# EAGLE schematic board (EAGLE 9.5.0)

## Sheet 1 of 2
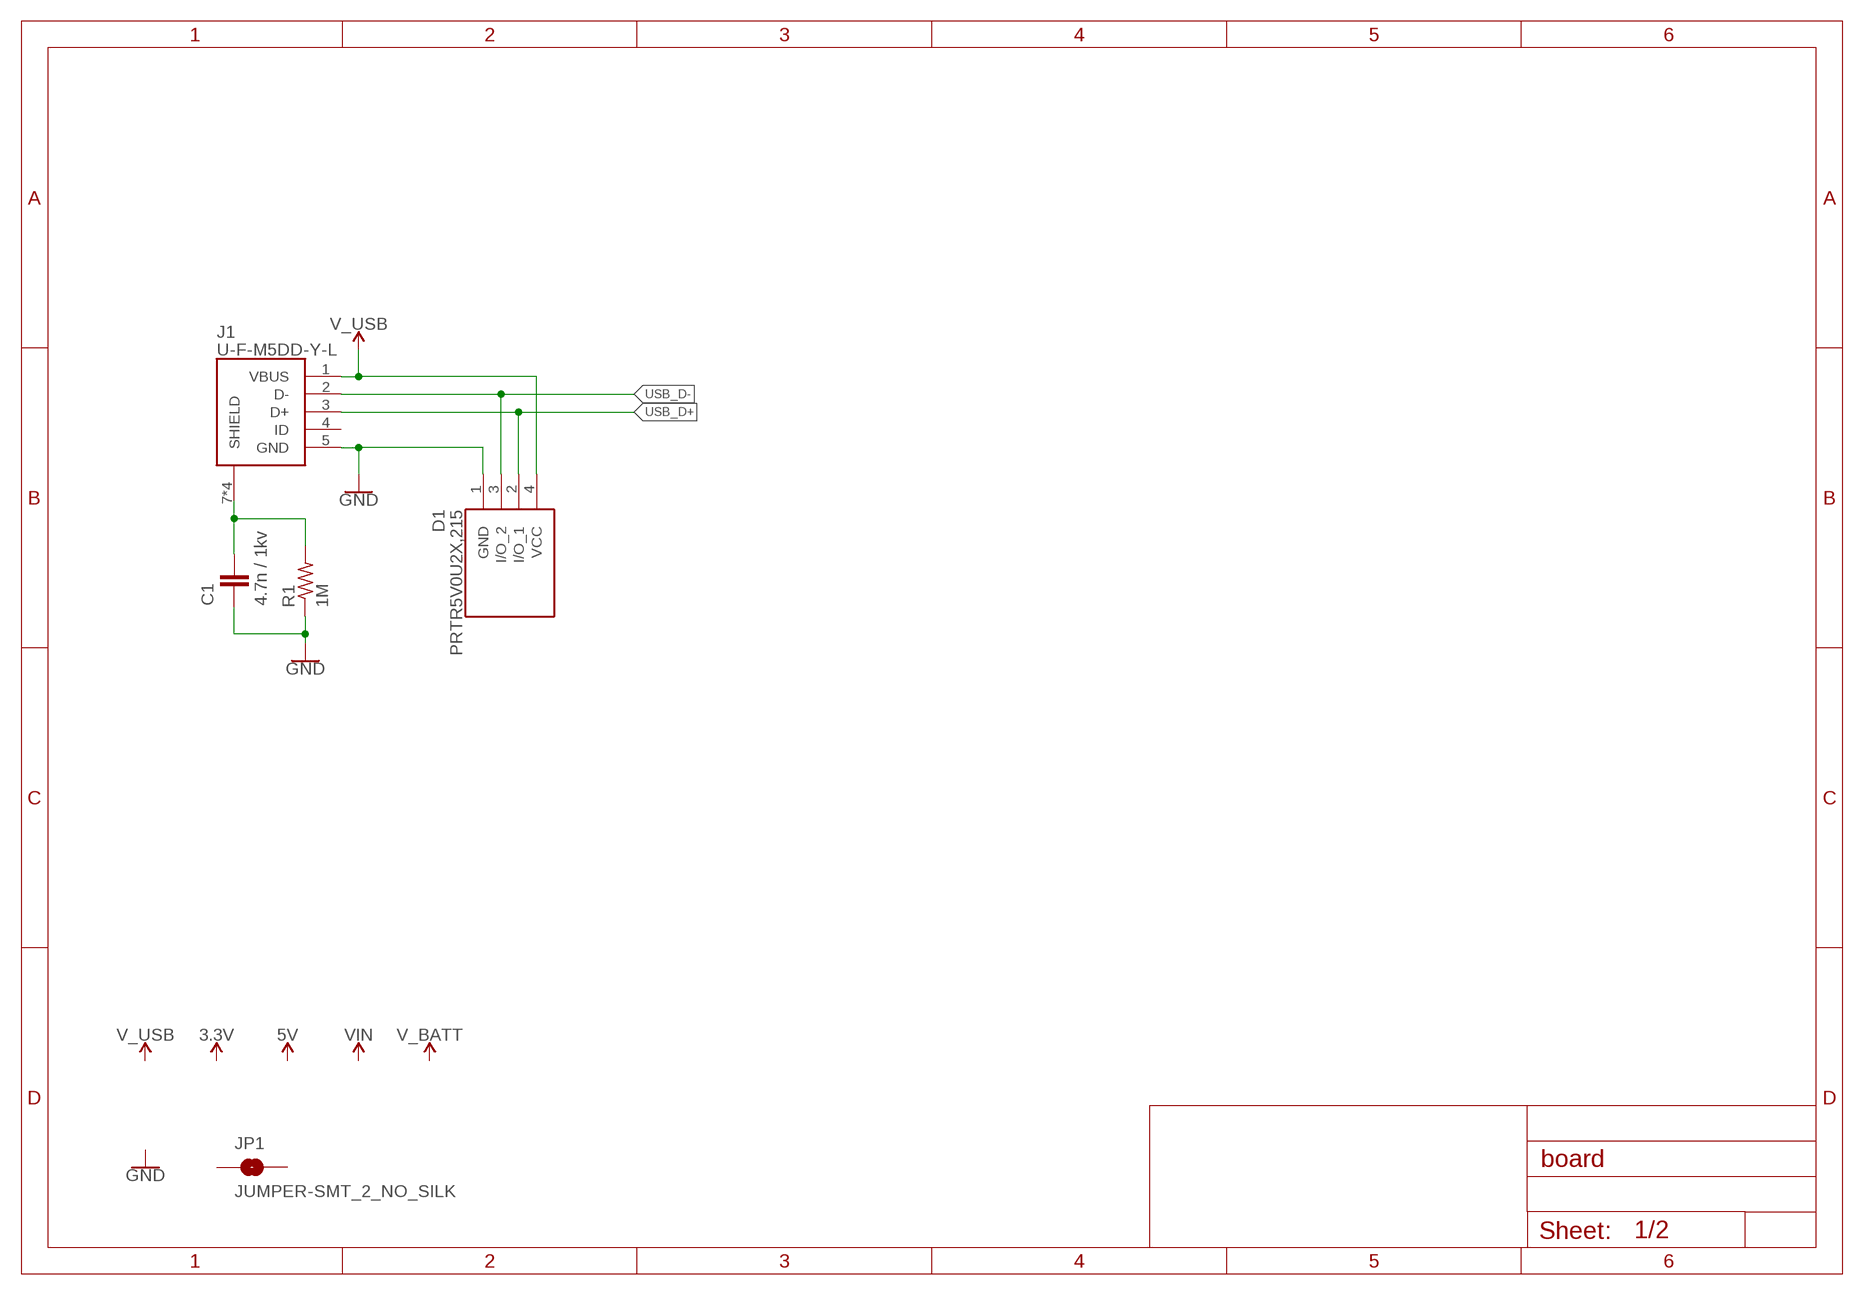
[diagram p0: schematic, sheet 1]

### Parts
C1  4.7n / 1kv  C-EUC0402K  [C0402K]
D1  PRTR5V0U2X,215  [SOT-143B]
J1  U-F-M5DD-Y-L  [UFM5DDYL]
JP1  JUMPER-SMT_2_NO_SILK  [SMT-JUMPER_2_NO_SILK]
R1  1M  R-US_R0402  [R0402]

### Nets
GND [power]: C1.2 D1.1(GND) J1.5(GND) R1.1
N$1: C1.1 J1.7(SHIELD) J1.8(SHIELD) J1.9(SHIELD) J1.10(SHIELD) R1.2
USB_D+: D1.2(I/O_1) J1.3(D+)
USB_D-: D1.3(I/O_2) J1.2(D-)
V_USB [power]: D1.4(VCC) J1.1(VBUS)
Unconnected: J1.4(ID) JP1.1 JP1.2

## Sheet 2 of 2
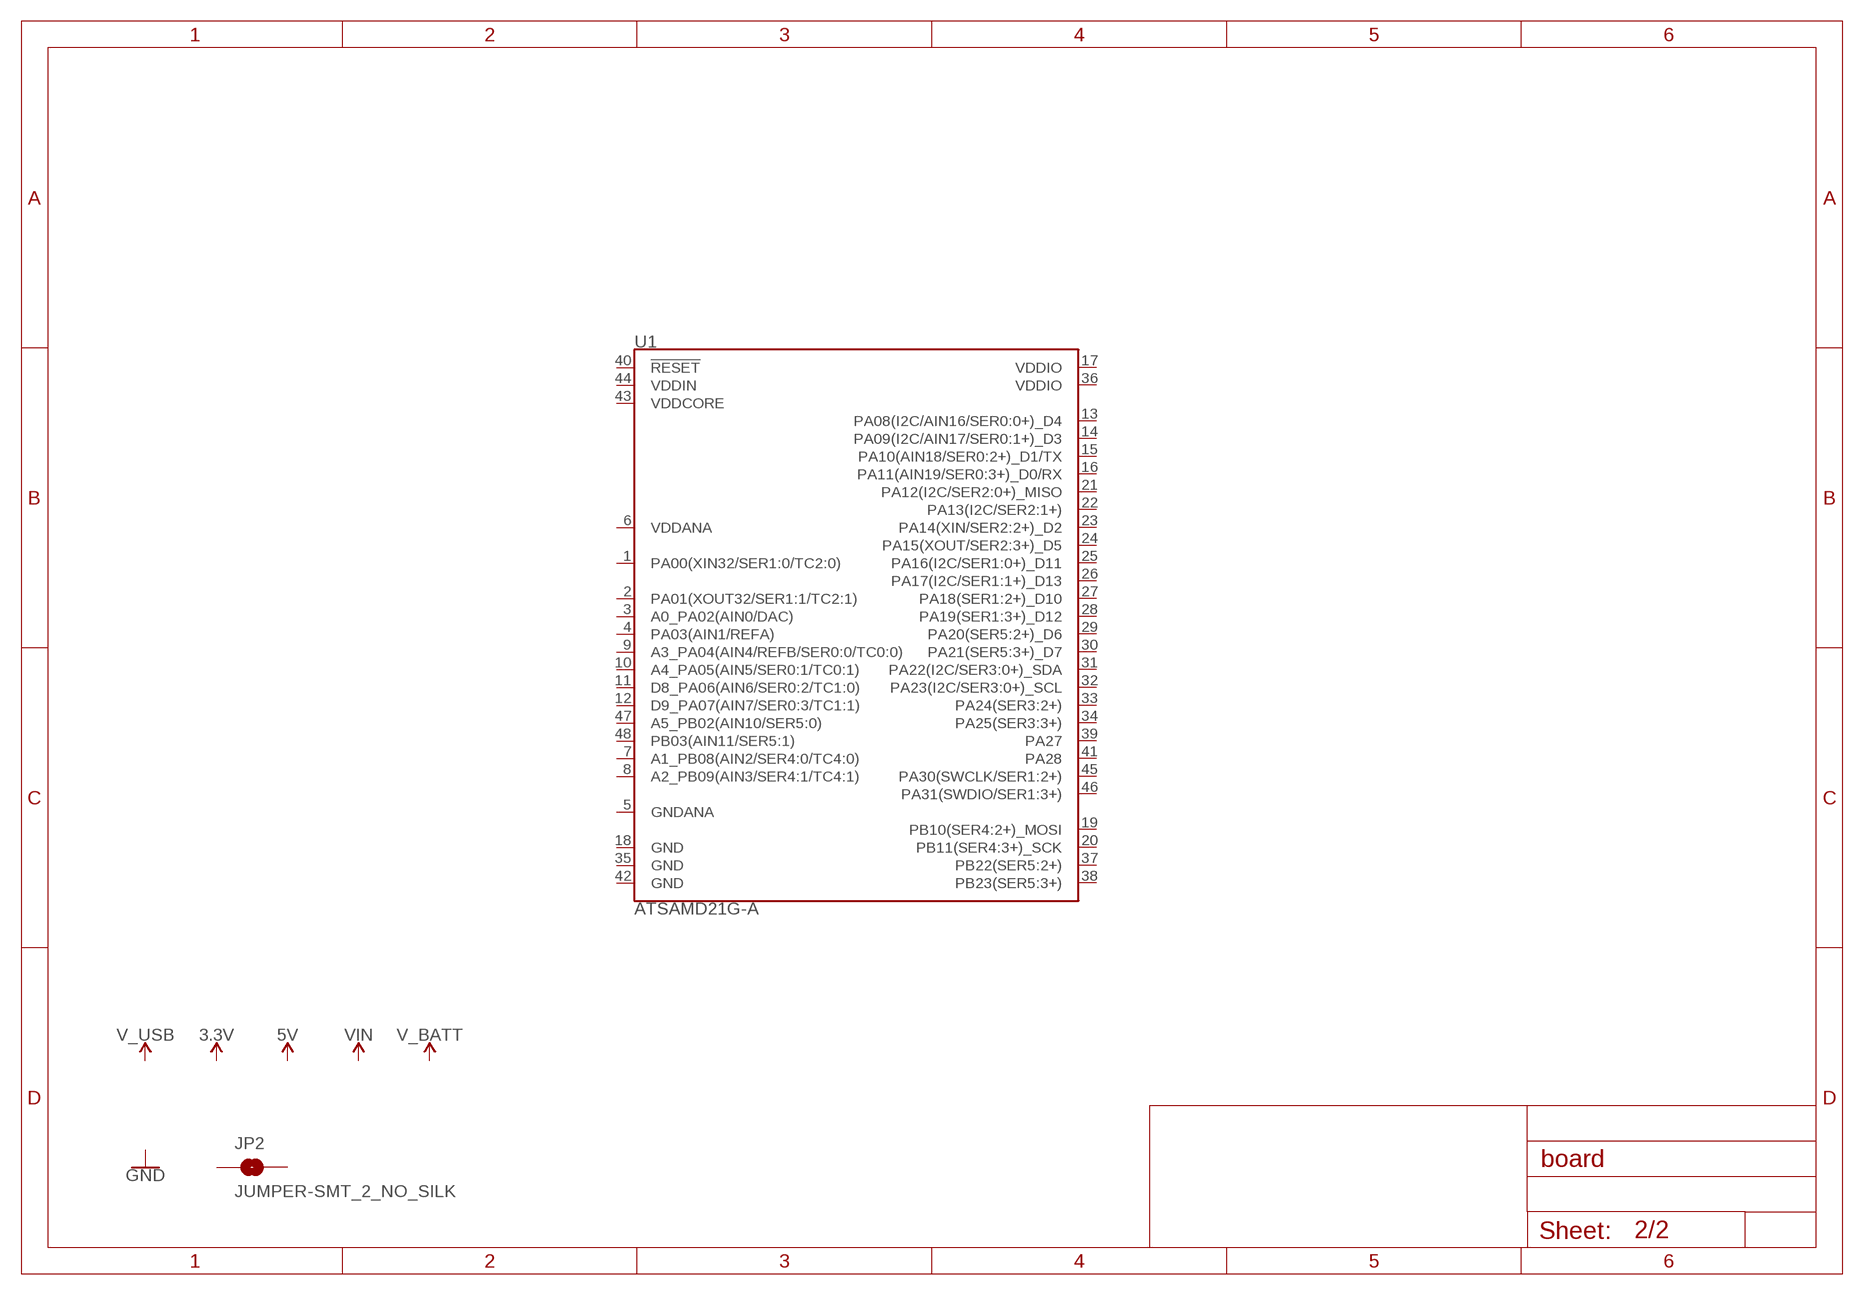
[diagram p1: schematic, sheet 2]

### Parts
JP2  JUMPER-SMT_2_NO_SILK  [SMT-JUMPER_2_NO_SILK]
U1  ATSAMD21G-A  [TQFP-48]
Unconnected: JP2.1 JP2.2 U1.1(PA00(XIN32/SER1:0/TC2:0)) U1.2(PA01(XOUT32/SER1:1/TC2:1)) U1.3(A0_PA02(AIN0/DAC)) U1.4(PA03(AIN1/REFA)) U1.5(GNDANA) U1.6(VDDANA) U1.7(A1_PB08(AIN2/SER4:0/TC4:0)) U1.8(A2_PB09(AIN3/SER4:1/TC4:1)) U1.9(A3_PA04(AIN4/REFB/SER0:0/TC0:0)) U1.10(A4_PA05(AIN5/SER0:1/TC0:1)) U1.11(D8_PA06(AIN6/SER0:2/TC1:0)) U1.12(D9_PA07(AIN7/SER0:3/TC1:1)) U1.13(PA08(I2C/AIN16/SER0:0+)_D4) U1.14(PA09(I2C/AIN17/SER0:1+)_D3) U1.15(PA10(AIN18/SER0:2+)_D1/TX) U1.16(PA11(AIN19/SER0:3+)_D0/RX) U1.17(VDDIO) U1.18(GND) U1.19(PB10(SER4:2+)_MOSI) U1.20(PB11(SER4:3+)_SCK) U1.21(PA12(I2C/SER2:0+)_MISO) U1.22(PA13(I2C/SER2:1+)) U1.23(PA14(XIN/SER2:2+)_D2) U1.24(PA15(XOUT/SER2:3+)_D5) U1.25(PA16(I2C/SER1:0+)_D11) U1.26(PA17(I2C/SER1:1+)_D13) U1.27(PA18(SER1:2+)_D10) U1.28(PA19(SER1:3+)_D12) U1.29(PA20(SER5:2+)_D6) U1.30(PA21(SER5:3+)_D7) U1.31(PA22(I2C/SER3:0+)_SDA) U1.32(PA23(I2C/SER3:0+)_SCL) U1.33(PA24(SER3:2+)) U1.34(PA25(SER3:3+)) U1.35(GND) U1.36(VDDIO) U1.37(PB22(SER5:2+)) U1.38(PB23(SER5:3+)) U1.39(PA27) U1.40(!RESET!) U1.41(PA28) U1.42(GND) U1.43(VDDCORE) U1.44(VDDIN) U1.45(PA30(SWCLK/SER1:2+)) U1.46(PA31(SWDIO/SER1:3+)) U1.47(A5_PB02(AIN10/SER5:0)) U1.48(PB03(AIN11/SER5:1))

## Library data of the parts
C1 = rcl:C-EU: CAPACITOR, European symbol; SPICEPREFIX: C
D1 = SamacSys_Parts:PRTR5V0U2X,215: ESD Protection Diodes 5.5V Dual SOT143B NXP PRTR5V0U2X,215 Dual Uni-Directional TVS Diode, 4-Pin SOT-143B Source: Datasheet <https://datasheet.lcsc.com/szlcsc/Nexperia-PRTR5V0U2X-215_C12333.pdf>; DESCRIPTION: ESD Protection Diodes 5.5V Dual SOT143B NXP PRTR5V0U2X,215 Dual Uni-Directional TVS Diode, 4-Pin SOT-143B; HEIGHT: mm; LCSC_PART_NUMBER: C12333; LCSC_PRICE-STOCK: https://lcsc.com/product-detail/Diodes-ESD_Nexperia_PRTR5V0U2X-215_PRTR5V0U2X-215_C12333.html; MANUFACTURER_NAME: Nexperia; MANUFACTURER_PART_NUMBER: PRTR5V0U2X,215
J1 = SamacSys_Parts:U-F-M5DD-Y-L: USB Connector Source: Datasheet <https://datasheet.lcsc.com/szlcsc/1903211730_Korean-Hroparts-Elec-U-F-M5DD-Y-L_C91146.pdf>; DESCRIPTION: USB Connector; HEIGHT: 3.4mm; LCSC_PART_NUMBER: C91146; LCSC_PRICE-STOCK: https://lcsc.com/product-detail/Micro-USB-Connectors_Korean-Hroparts-Elec-U-F-M5DD-Y-L_C91146.html; MANUFACTURER_NAME: Korean Hroparts Elec; MANUFACTURER_PART_NUMBER: U-F-M5DD-Y-L
JP1 JP2 = SparkFun-Jumpers:JUMPER-SMT_2_NO: Normally open jumper This jumper has two pads in close proximity to each other. Apply solder to close the connection. Round pads are easier to solder for beginners, but are a lot larger. SparkFun Product that uses the round pads: SparkFun EL Sequencer <https://www.sparkfun.com/products/12781>
R1 = rcl:R-US_: RESISTOR, American symbol; SPICEPREFIX: R
U1 = SparkFun-IC-Microcontroller:ATSAMD21G: Atmel SAMD21G SMART ARM-Based Microcontroller The Atmel ® | SMART ™ SAM D21 is a series of low-power microcontrollers using the 32-bit ARM ® Cortex ® -M0+ processor, and ranging from 32- to 64-pins with up to 256KB Flash and 32KB of SRAM. The SAM D21 devices operate at a maximum frequency of 48MHz and reach 2.46 CoreMark/MHz. They are designed for simple and intuitive migration with identical peripheral modules, hex compatible code, identical linear address map and pin compatible migration paths between all devices in the product series. All devices include intelligent and flexible peripherals, Atmel Event System for inter-peripheral signaling, and support for capacitive touch button, slider and wheel user interfaces. Datasheet <https://cdn.sparkfun.com/datasheets/Dev/Arduino/Boards/Atmel-42181-SAM-D21_Datasheet.pdf> SparkFun Products SparkFun SAMD21 Mini Breakout <https://www.sparkfun.com/products/13664> (DEV-13664) SparkFun SAMD21 Dev Breakout <https://www.sparkfun.com/products/13672> (DEV-13672) (DEV-14926); PROD_ID: IC-13064

## Net classes
0 default: width 0.203 mm
1 power: width 0.508 mm